# Altium schematic sheet STM32_Lvl-Shft_MCU.SchDoc
size A; SheetNumber: 3; SheetTotal: 5
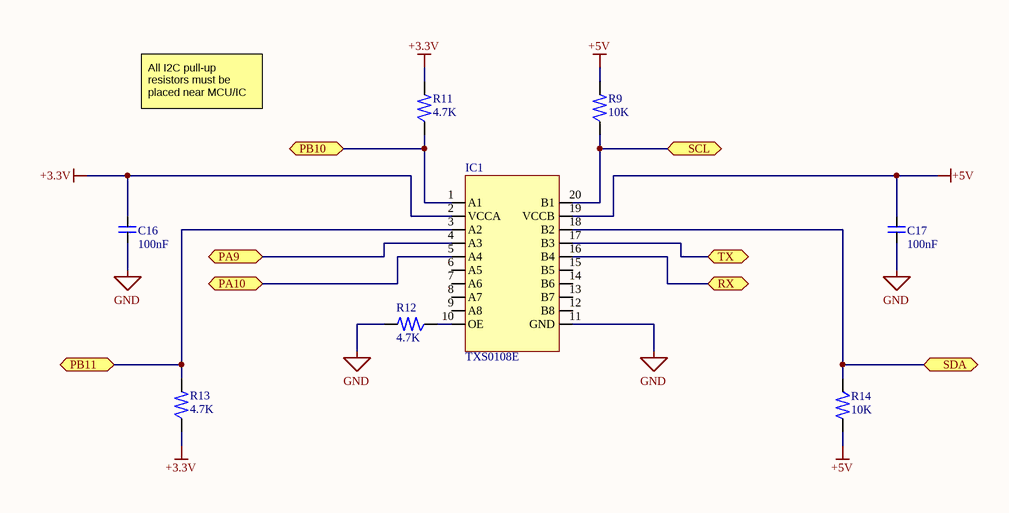
[diagram p0: STM32_Lvl-Shft_MCU.SchDoc]

## Parts
C16  100nF  [SMT_CAP_MODEL_1206(3216)_SAMSUNG]
C17  100nF  [SMT_CAP_MODEL_1206(3216)_SAMSUNG]
IC1  TXS0108E  [SMT_TXS0108E_IC]
R9  10K  [SMT_RES_MODEL_1206(3216)_ROHM]
R11  4.7K  [SMT_RES_MODEL_1206(3216)_ROHM]
R12  4.7K  [SMT_RES_MODEL_1206(3216)_ROHM]
R13  4.7K  [SMT_RES_MODEL_1206(3216)_ROHM]
R14  10K  [SMT_RES_MODEL_1206(3216)_ROHM]

## Ports
PA9 (bidir), PA10 (bidir), PB10 (bidir), PB11 (bidir), RX (bidir), SCL (bidir), SDA (bidir), TX (bidir)

## Nets
+3.3V: C16.1 IC1.2(VCCA) R11.1 R13.2
+5V: C17.1 IC1.19(VCCB) R9.1 R14.1
GND: C16.2 C17.2 IC1.11(GND) R12.1
PA9: IC1.4(A3) ; port PA9
PA10: IC1.5(A4) ; port PA10
PB10: IC1.1(A1) R11.2 ; port PB10
PB11: IC1.3(A2) R13.1 ; port PB11
RX: IC1.16(B4) ; port RX
SCL: IC1.20(B1) R9.2 ; port SCL
SDA: IC1.18(B2) R14.2 ; port SDA
TX: IC1.17(B3) ; port TX
NetIC1_10: IC1.10(OE) R12.2

Not connected (* = marked no-connect by the designer): IC1 6(A5) 7(A6) 8(A7) 9(A8) 12(B8) 13(B7) 14(B6) 15(B5)

## Notes on the sheet
- All I2C pull-up resistors must be placed near MCU/IC

## Library data of the parts
C16 C17 = SMT_CAP_MODEL_1206(3216)_SAMSUNG: SMT Samsung Ceramic Capacitor MODEL *V *nF 1206(3216)  CL31B104KBCNNNC(etc.)
IC1 = SMT_TXS0108E_IC: TXS0108E 8-BIT Bi-Directional Level Shifter 1.2-3.6V(A) 1.65-5.5V(B)
R9 R11-R14 = SMT_RES_MODEL_1206(3216)_ROHM: SMT ROHM Resistor MODEL 1206(3216) 1/4W MCR18ERTJ000